# EasyEDA schematic HUB75Wiring.json
TITLE: Sheet_1; REV: 1.0; Date: 2026-05-06; Sheet: 1/1; Drawn By: pkhrissanov; Company: Your Company
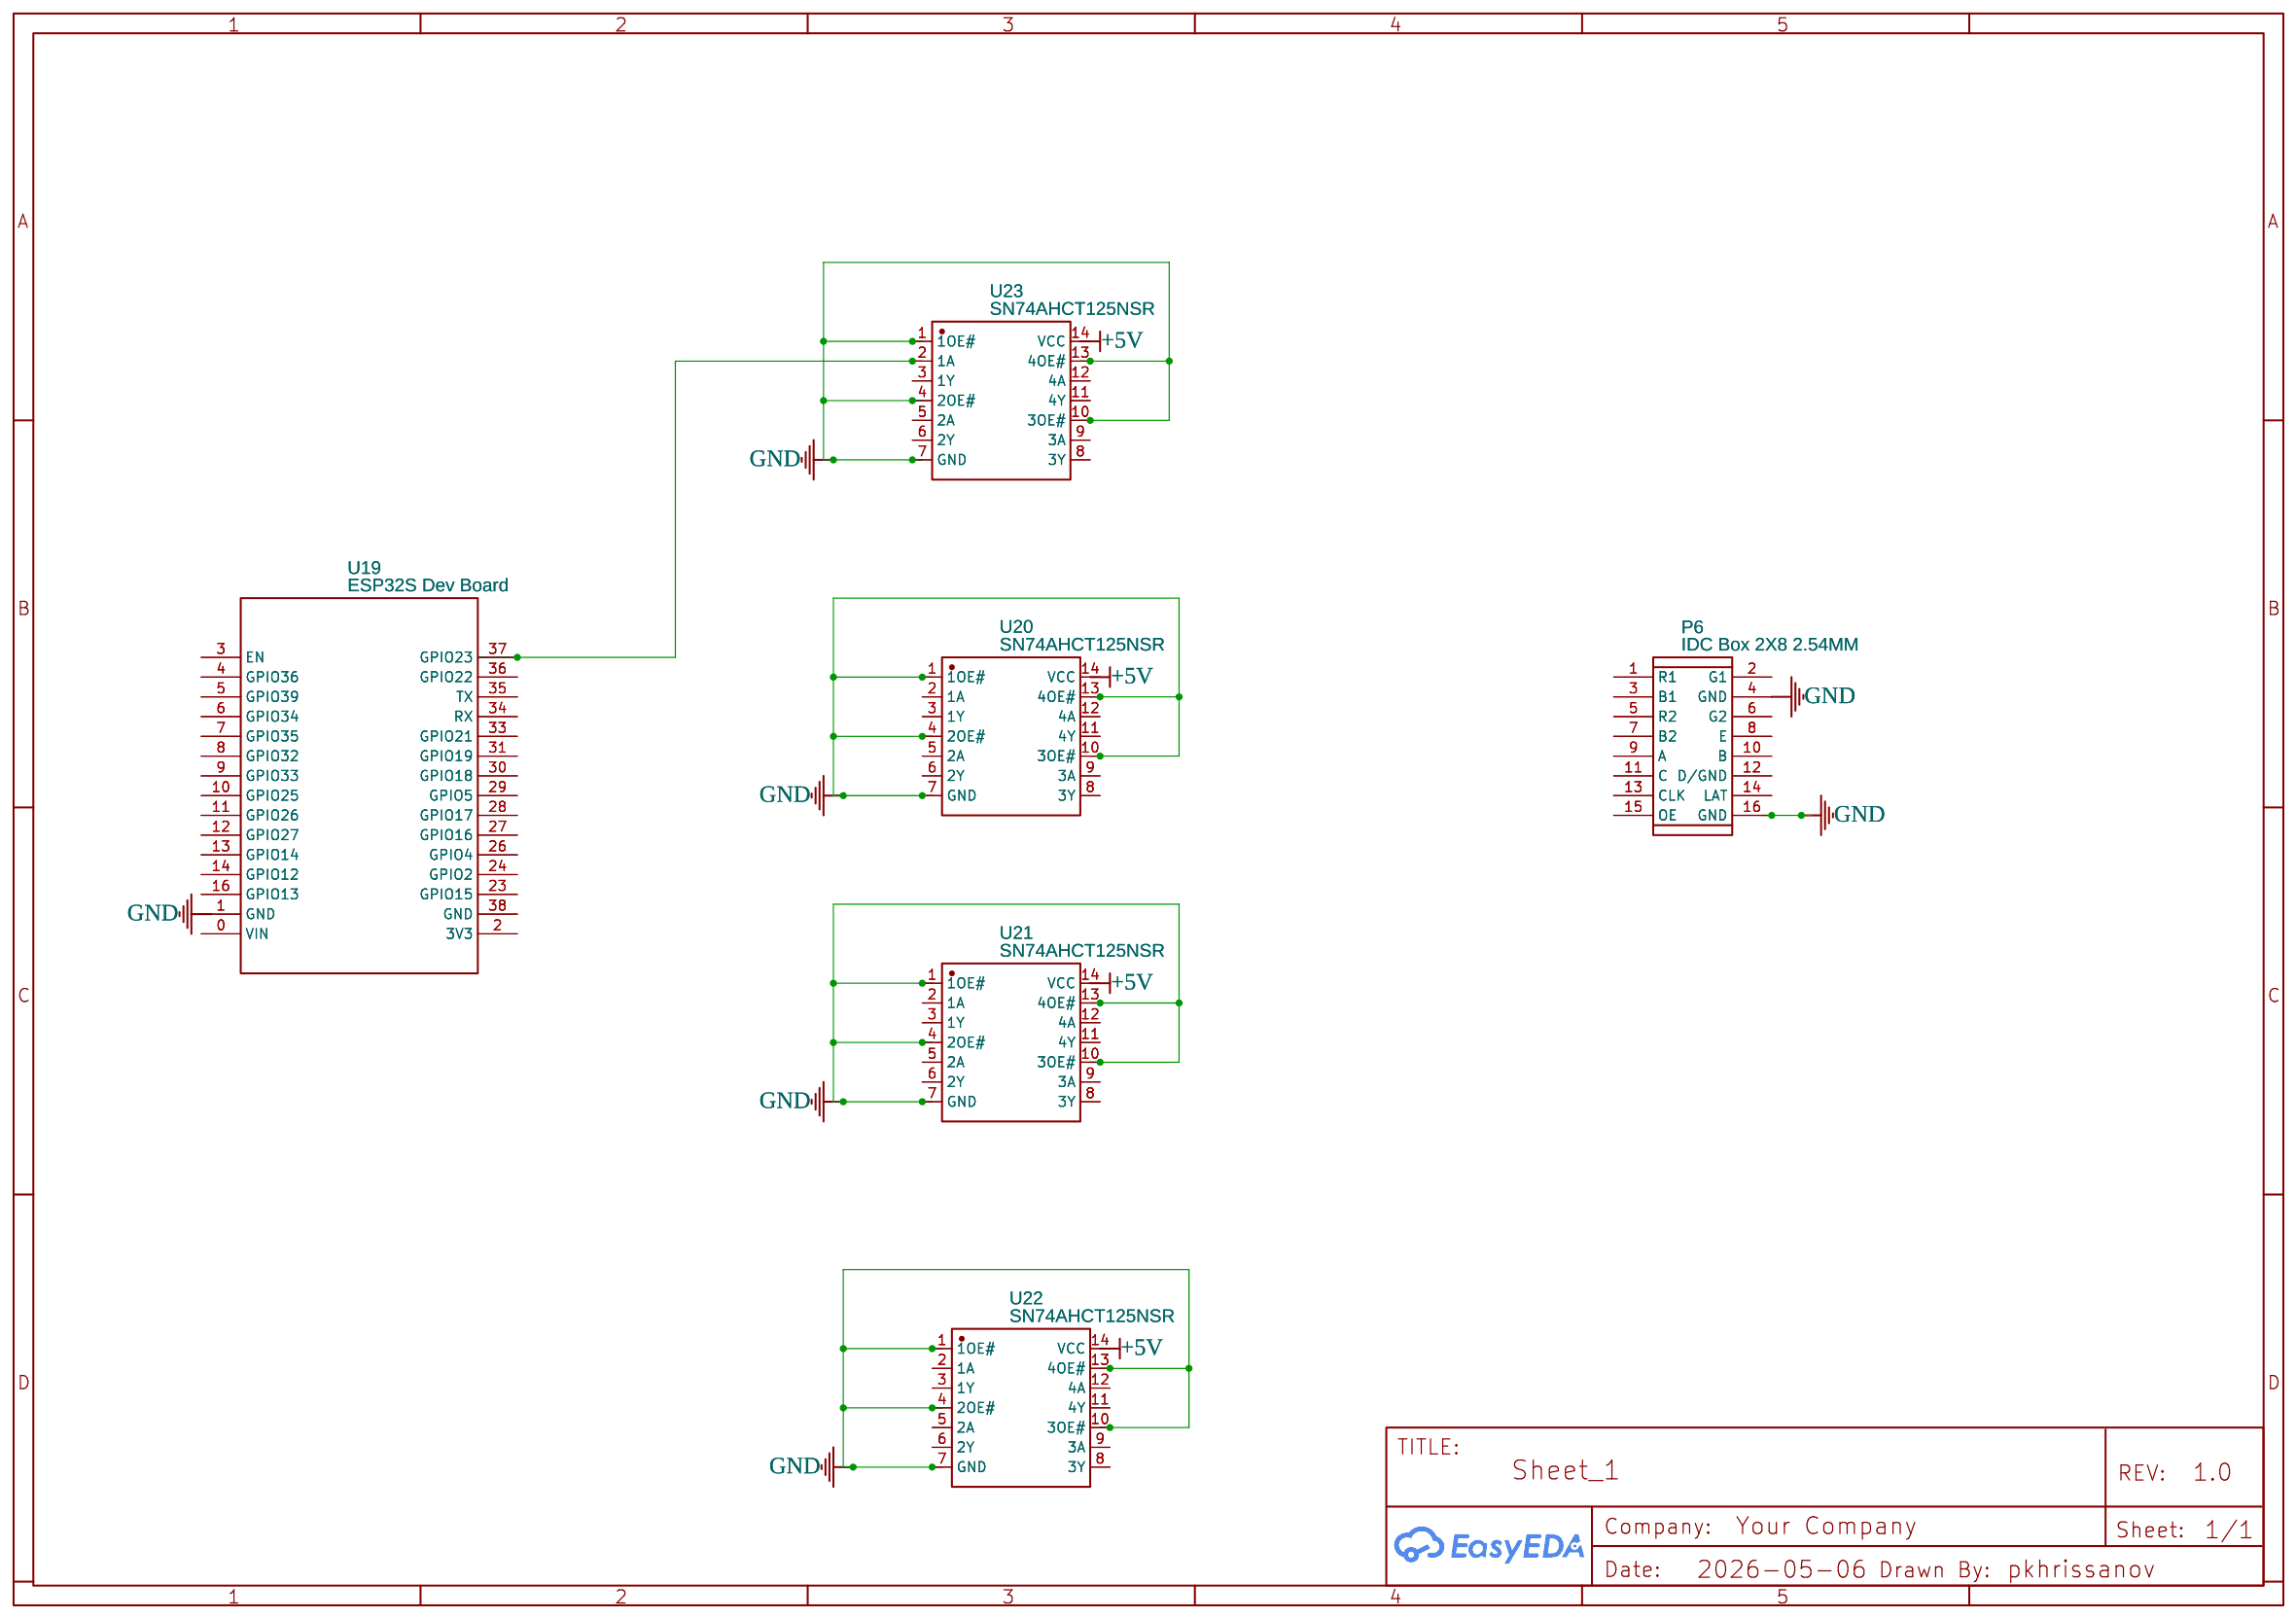
[diagram p0: schematic sheet]

## Parts
P6  IDC Box 2X8 2.54MM  [CONN-TH_16P-P2.54_C9142]
U19  ESP32S Dev Board  [ESP32S DEV BOARD FOOTPRINT]
U20  SN74AHCT125NSR  [SOP-14_L10.2-W5.3-P1.27-LS7.8-BL]
U21  SN74AHCT125NSR  [SOP-14_L10.2-W5.3-P1.27-LS7.8-BL]
U22  SN74AHCT125NSR  [SOP-14_L10.2-W5.3-P1.27-LS7.8-BL]
U23  SN74AHCT125NSR  [SOP-14_L10.2-W5.3-P1.27-LS7.8-BL]

## Library data of the parts
P6 = IDC Box 2X8 2.54MM: Supplier: LCSC; Manufacturer: BOOMELE(博穆精密); Manufacturer Part: 2.54-2*8P弯简牛; Supplier Part: C9142; JLCPCB Part Class: Extended Part
U19 = ESP32S Dev Board: Manufacturer: ELEGOO; Manufacturer Part: EL-SM-012; Supplier: Amazon; Supplier Part: EL-SM-012; link: https://www.amazon.com/stores/page/E0F05684-D7AD-47CF-B08C-4084EBEE5BD3?ingress=2&visitId=046ce550-5dca-4475-bc5e-5b14e0c0476f&store_ref=bl_ast_dp_brandLogo_sto&ref_=ast_bln; Contributor: adludwig
U20-U23 = SN74AHCT125NSR: Contributor: LCSC; Supplier: LCSC; Supplier Part: C2675672; Manufacturer: TI(德州仪器); JLCPCB Part Class: Extended Part

## Nets
GND: P6.4(GND) P6.16(GND) U20.1(1OE#) U20.4(2OE#) U20.7(GND) U20.10(3OE#) U20.13(4OE#) U21.1(1OE#) U21.4(2OE#) U21.7(GND) U21.10(3OE#) U21.13(4OE#) U22.1(1OE#) U22.4(2OE#) U22.7(GND) U22.10(3OE#) U22.13(4OE#) U23.1(1OE#) U23.4(2OE#) U23.7(GND) U23.10(3OE#) U23.13(4OE#)
Net-(U19-37): U19.37(GPIO23) U23.2(1A)

Not connected (* = marked no-connect by the designer): P6 1(R1) 2(G1) 3(B1) 5(R2) 6(G2) 7(B2) 8(E) 9(A) 10(B) 11(C) 12(D/GND) 13(CLK) 14(LAT) 15(OE); U19 0(VIN) 1(GND) 2(3V3) 3(EN) 4(GPIO36) 5(GPIO39) 6(GPIO34) 7(GPIO35) 8(GPIO32) 9(GPIO33) 10(GPIO25) 11(GPIO26) 12(GPIO27) 13(GPIO14) 14(GPIO12) 16(GPIO13) 23(GPIO15) 24(GPIO2) 26(GPIO4) 27(GPIO16) 28(GPIO17) 29(GPIO5) 30(GPIO18) 31(GPIO19) 33(GPIO21) 34(RX) 35(TX) 36(GPIO22) 38(GND); U20 2(1A) 3(1Y) 5(2A) 6(2Y) 8(3Y) 9(3A) 11(4Y) 12(4A) 14(VCC); U21 2(1A) 3(1Y) 5(2A) 6(2Y) 8(3Y) 9(3A) 11(4Y) 12(4A) 14(VCC); U22 2(1A) 3(1Y) 5(2A) 6(2Y) 8(3Y) 9(3A) 11(4Y) 12(4A) 14(VCC); U23 3(1Y) 5(2A) 6(2Y) 8(3Y) 9(3A) 11(4Y) 12(4A) 14(VCC)
